# Altium schematic sheet Main.SchDoc: MicroCO2Sensor
size A; DrawnBy: Sindre Hovland; Organization: Open sauce; Revision: V0; SheetNumber: 1; SheetTotal: 5
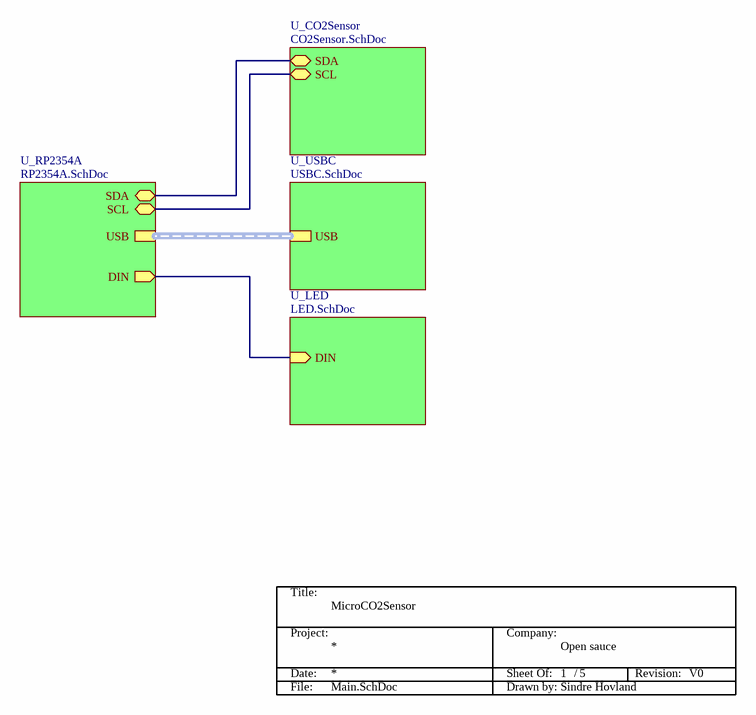
[diagram p0: Main.SchDoc]

## Parts
*  TitleBlock  (value not drawn)  (graphical)

## Sub-sheets
U_CO2Sensor = CO2Sensor.SchDoc: SDA (bidir), SCL (bidir)
U_LED = LED.SchDoc: DIN (in)
U_RP2354A = RP2354A.SchDoc: USB, DIN (out), SCL (bidir), SDA (bidir)
U_USBC = USBC.SchDoc: USB (harness USB)

## Nets
(unnamed): sheet U_CO2Sensor/SDA, sheet U_RP2354A/SDA
(unnamed): sheet U_CO2Sensor/SCL, sheet U_RP2354A/SCL
(unnamed): sheet U_LED/DIN, sheet U_RP2354A/DIN

## Buses and harness runs
harness sheet U_RP2354A/USB = sheet U_USBC/USB

## Notes on the sheet
- (in symbol TitleBlock) Title:; Project:; Company:; Date:; Sheet Of:; /; Revision:; File:; Drawn by: